# Altium project UZ_D_Optical_Daughter.PrjPcb
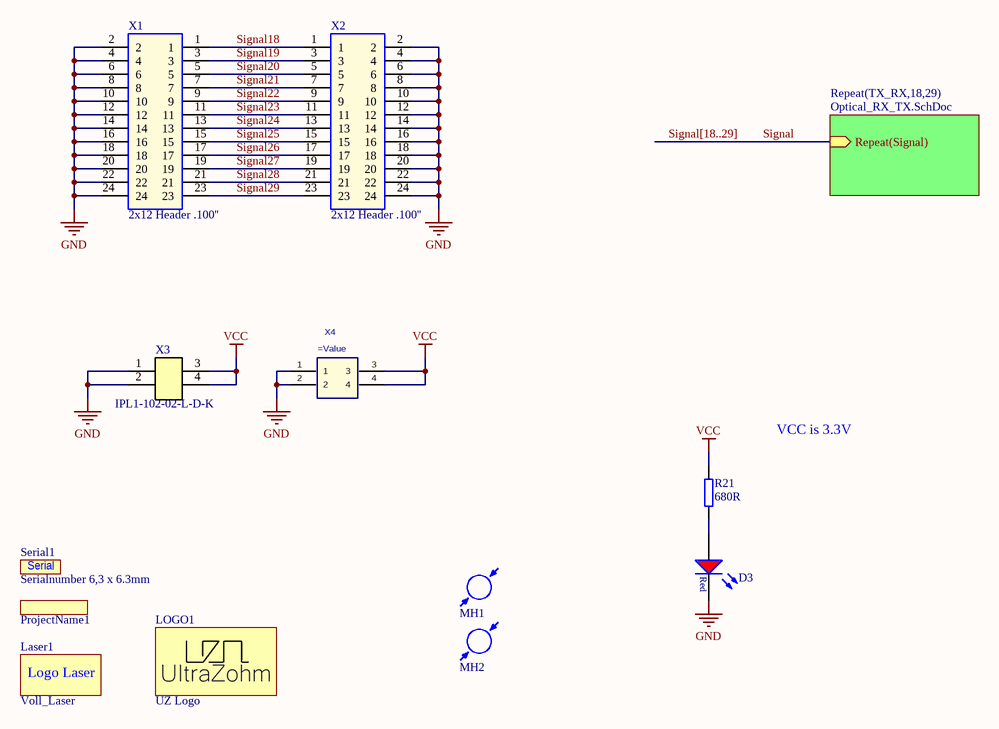
[diagram p0: TopSheet.SchDoc]
Author: E. Aufderheide; AuthorParam: E. Aufderheide; Date: 09/25; GGG: 000; PPP: 018; ProjectName: Digital_Optical_Daugther; ProjectRevision: Rev02; Rev: 02; vv: vv
2 sheets, 252 parts. Net scope: hierarchical (ports join the sheet entries above them; power ports are global).
Board file: UZ_D_Optical_Daughter.PcbDoc
Sheets:
  TopSheet.SchDoc
    TX_RX18 = Optical_RX_TX.SchDoc
    TX_RX19 = Optical_RX_TX.SchDoc
    TX_RX20 = Optical_RX_TX.SchDoc
    TX_RX21 = Optical_RX_TX.SchDoc
    TX_RX22 = Optical_RX_TX.SchDoc
    TX_RX23 = Optical_RX_TX.SchDoc
    TX_RX24 = Optical_RX_TX.SchDoc
    TX_RX25 = Optical_RX_TX.SchDoc
    TX_RX26 = Optical_RX_TX.SchDoc
    TX_RX27 = Optical_RX_TX.SchDoc
    TX_RX28 = Optical_RX_TX.SchDoc
    TX_RX29 = Optical_RX_TX.SchDoc

## Sheet TopSheet.SchDoc
size A4; Author: E. Aufderheide; CompanyName: Technische Hochschule Nürnberg Georg Simon Ohm; Organization: UltraZohm; Address1: Kesslerplatz 12; Address2: 90489 Nürnberg; Address3: GERMANY; DocumentNumber: 1; SheetNumber: 1; SheetTotal: 2; Website: www.ultrazohm.com

### Parts
D3  150060RS75000  [WL-SMCW_0603]  (value not drawn)
Laser1  Voll_Laser  [Voll_Laser]  (no BOM)
LOGO1  UZ Logo  [UZ_Logo_small]  (no BOM)
MH1  (no value)  [MH_2.8]  (no BOM)
MH2  (no value)  [MH_2.8]  (no BOM)
ProjectName1  Project Name, Rev  [ID_ProjectRev]  (value not drawn)  (no BOM)
R21  680R  [R_0603_N]
Serial1  Serialnumber 6,3 x 6.3mm  [Serial_6.3x6.3mm]  (no BOM)
X1  2x12 Header .100''  [TST-112-01-G-D]
X2  2x12 Header .100''  [TST-112-01-G-D]
X3  IPL1-102-02-L-D-K  [IPL1-102-02-L-D-K-0]
X4  (no value)  [IPL1-102-01-L-D-K]

### Sub-sheets
Repeat(TX_RX,18,29) = Optical_RX_TX.SchDoc: Repeat(Signal) (in)

### Nets
GND: D3.1(K) X1.2 X1.4 X1.6 X1.8 X1.10 X1.12 X1.14 X1.16 X1.18 X1.20 X1.22 X1.24 X2.2 X2.4 X2.6 X2.8 X2.10 X2.12 X2.14 X2.16 X2.18 X2.20 X2.22 X2.24 X3.1 X3.2 X4.1 X4.2
VCC: R21.2 X3.3 X3.4 X4.3 X4.4
Signal: sheet Repeat(TX_RX,18,29)/Repeat(Signal)
Signal18: X1.1 X2.1
Signal19: X1.3 X2.3
Signal20: X1.5 X2.5
Signal21: X1.7 X2.7
Signal22: X1.9 X2.9
Signal23: X1.11 X2.11
Signal24: X1.13 X2.13
Signal25: X1.15 X2.15
Signal26: X1.17 X2.17
Signal27: X1.19 X2.19
Signal28: X1.21 X2.21
Signal29: X1.23 X2.23
NetD3_2: D3.2(A) R21.1

### Buses and harness runs
bus Signal[18..29]

### Notes on the sheet
- VCC is 3.3V
- Title
- Revision:
- Design Engineer:
- Date:
- Project:
- Sheet
- of
- (in symbol SerialNumber) Serial
- (in symbol Voll_Laser) Logo Laser

### Library data of the parts
D3 = LED_Red_0603: WL-SMCW SMD Mono-color Chip LED Waterclear, size 0603, Red, 2 V, 140°; Forward Voltage: 2 V; Luminous Intensity: 250 mcd; Peak Wavelength: 630 nm; Dominant Wavelength: 625 nm; MF: Wuerth Elektronik; Published Date: Sep. 2017; ComponentLink1Description: Manufacturer; ComponentLink1URL: http://www.we-online.de; ComponentLink2Description: Datasheet; ComponentLink2URL: http://katalog.we-online.com/led/datasheet/150060RS75000.pdf; MPN: 150060RS75000; Size: 0603; Viewing Angle: 140°; Emitting Color: Red; Value: 150060RS75000; Package: 0603; Created: 2018_09_06_AGeiger; Supplier 1: Farnell; Supplier Part Number 1: 2322071; Supplier 2: Mouser; Supplier Part Number 2: 710-150060RS75000; Supplier 3: Digi-Key; Supplier Part Number 3: 732-4978-1-ND; LCSC Part Number: C2286
Laser1 = Voll_Laser: Logo Laser Warning Sign
LOGO1 = UZ Logo: UltraZohm Logo on PCB; Created: Jan2021_Liegmann; Value: UZ Logo
MH1 MH2 = Mounting Hole: Non plated through hole
ProjectName1 = ID_ProjectRev: Project Name and Revision Number; Created: 2018_11_23_AGeiger; Value: Project Name, Rev
R21 = R_0603: SMD Resistor 0603; MPN: CR0603-FX-3901ELF; Tolerance: 1%; Voltage: 75V; Power: 100 mW; MF: Bourns; Package: 0603; Value: 680R; Created: 2018_09_06_AGeiger; Supplier 1: Mouser; Supplier Part Number 1: 652-CR0603-FX3901ELF; LCSC Part Number: C23228
Serial1 = SerialNumber: Created: 2018_09_18_AGeiger; Value: Serialnumber 6,3 x 6.3mm
X1 X2 = TST-112-01-G-D: Double Row, 12 positions, Shrouded Terminal Header .100''; MF: Samtec; Created: 2020_04_Kreppel; MPN: TST-112-01-G-D; Supplier 1: Mouser; Supplier Part Number 1: 200-TST11201GD; LCSC Part Number: C5372869
X3 = IPL1-102-02-L-D-K: P=2.54mm Wire To Board Connector ROHS; Manufacturer: SAMTEC; Created from: KIlhan; Number of positions: 2; Manufacturer Part Number: IPL1-102-02-L-D-K; PartID: 59; Created On: 20/03/2025 08:58:37; ComponentLink1Description: Datasheet; ComponentLink1URL: https://wmsc.lcsc.com/wmsc/upload/file/pdf/v2/lcsc/2312312026_Samtec-IPL1-102-02-L-D-K_C7437440.pdf; Component Type: Samtec Connector; Device Package: Connector; Last Updated: 20/03/2025 09:02:48; Mounting Type: THT; Operating Temperature: -55 - +125 °C; Supplier 1: Mouser; Supplier Part Number 1: 200-IPL110202LDK; Supplier 2: LCSC; Supplier Part Number 2: C7437440; Type: Connector; Live Cycle Status: 1; Number of rows: 2; LCSC Part Number: C7437440; Stock number: not stored
X4 = IPL1-102-XX-X-D-X: 2.54mm Double Row Terminal Assembly, Right-Angled; Manufacturer: SAMTEC; Created: 2018_05_02_AGeiger; Value: =MPN; MPN: IPL1-102-01-L-D-K; LCSC Part Number: C5714565

## Sheet Optical_RX_TX.SchDoc
size A4; CompanyName: Technische Hochschule Nürnberg Georg Simon Ohm; Organization: UltraZohm; Address1: Kesslerplatz 12; Address2: 90489 Nürnberg; Address3: GERMANY; DocumentNumber: 2; SheetNumber: 2; SheetTotal: 2; Website: www.ultrazohm.com
Used 12 times, as channels TX_RX18, TX_RX19, TX_RX20, TX_RX21, TX_RX22, TX_RX23, TX_RX24, TX_RX25, TX_RX26, TX_RX27, TX_RX28, TX_RX29. Parts and nets are listed once, with the designators drawn on the sheet.
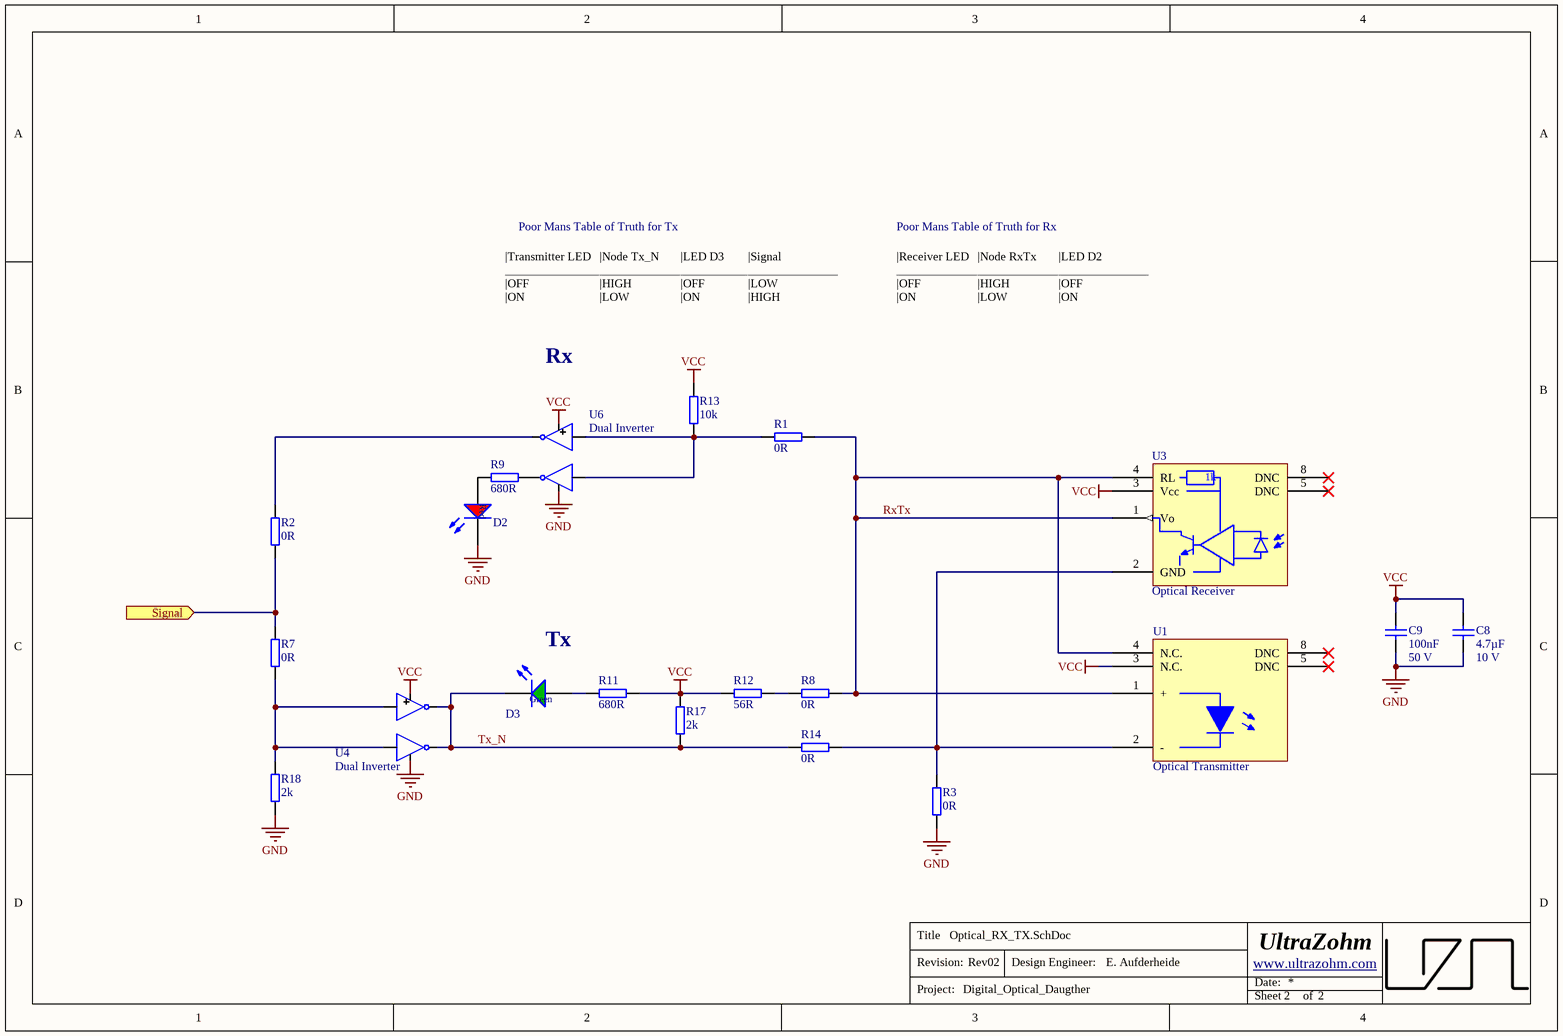
[diagram p1: Optical_RX_TX.SchDoc]

### Parts
C8  Voltage: 10 V  [CAP_2012X06N]  (hidden comment: 4.7µF)
C9  Rated Voltage: 50 V  [C_0603(1608)100_L]  (hidden comment: 100nF)
D2  150060RS75000  [WL-SMCW_0603]  (value not drawn)
D3  150060GS75000  [WL-SMCW_0603]  (value not drawn)
R1  0R  [R_0603_N]
R2  0R  [R_0603_N]
R3  0R  [R_0603_N]
R7  0R  [R_0603_N]
R8  0R  [R_0603_N]
R9  680R  [R_0603_N]
R11  680R  [R_0603_N]
R12  56R  [RES_2012X06N]
R13  10k  [R_0603_TE]
R14  0R  [R_0603_N]
R17  2k  [R_0603_N]
R18  2k  [R_0603_N]
U1  Optical Transmitter  [HFBRx5XX]
U3  Optical Receiver  [HFBRx5XX]
U4  Dual Inverter  [SN74LVC2GU04DCKR]
U6  Dual Inverter  [SN74LVC2GU04DCKR]

### Ports
Signal (in)

### Nets
GND: C8.2 C9.2 D2.1(K) R3.2 R18.1 U4.2(GND) U6.2(GND)
VCC: C8.1 C9.1 R11.1 R12.1 R13.2 R17.2 U1.3(N.C.) U3.3(Vcc) U4.5(VCC) U6.5(VCC)
RxTx: R1.2 R8.2 U1.1(+) U1.4(N.C.) U3.1(Vo) U3.4(RL)
Signal: R2.1 R7.2 ; port Signal
Tx_N: D3.1(K) R14.1 R17.1 U4.4(OUT2) U4.6(OUT2)
NetD2_2: D2.2(A) R9.2
NetD3_2: D3.2(A) R11.2
NetR1_1: R1.1 R13.1 U6.1(IN1) U6.3(IN2)
NetR2_2: R2.2 U6.6(OUT2)
NetR3_1: R3.1 R14.2 U1.2(-) U3.2(GND)
NetR7_1: R7.1 R18.2 U4.1(IN1) U4.3(IN2)
NetR8_1: R8.1 R12.2
NetR9_1: R9.1 U6.4(OUT2)

Not connected (* = marked no-connect by the designer): U1 5(DNC)* 8(DNC)*; U3 5(DNC)* 8(DNC)*

### Channels
TX_RX18: designators end in A; ports Signal=Signal18
TX_RX19: designators end in B; ports Signal=Signal19
TX_RX20: designators end in C; ports Signal=Signal20
TX_RX21: designators end in D; ports Signal=Signal21
TX_RX22: designators end in E; ports Signal=Signal22
TX_RX23: designators end in F; ports Signal=Signal23
TX_RX24: designators end in G; ports Signal=Signal24
TX_RX25: designators end in H; ports Signal=Signal25
TX_RX26: designators end in I; ports Signal=Signal26
TX_RX27: designators end in J; ports Signal=Signal27
TX_RX28: designators end in K; ports Signal=Signal28
TX_RX29: designators end in L; ports Signal=Signal29

### Notes on the sheet
- Poor Mans Table of Truth for Tx
- Poor Mans Table of Truth for Rx
- |Transmitter LED
  _________________
  |OFF
  |ON
- |Node Tx_N
  _________________
  |HIGH
  |LOW
- |LED D3
  _______________
  |OFF
  |ON
- GATE
  _______
  LOW
  HIGH
- |Signal
  _______________
  |LOW
  |HIGH
- |Receiver LED
  ________________
  |OFF
  |ON
- |Node RxTx
  _________________
  |HIGH
  |LOW
- |LED D2
  _______________
  |OFF
  |ON
- Rx
- Tx
- Title
- Revision:
- Design Engineer:
- Date:
- Project:
- Sheet
- of
- (in symbol HFBR-2528Z) 1k

### Library data of the parts
C8 = C_0805: CAP 0805 (2012 Metric) SMD; MPN: LMF212B7475KGHT; Tolerance: ±10%; Case-Metric: 2012; Dielectric: X7R; MF: Taiyo Yuden; Case-EIA: 0805; Max Thickness: 1 mm; Technology: SMT; Created: 2018_09_06_AGeiger; Supplier 1: Mouser; Supplier Part Number 1: 963-LMF212B7475KGHT; Value: 4.7µF; Package: 0805; LCSC Part Number: C1779
C9 = C_0603: CAP 0603 (1608 Metric) SMD; Tolerance: ±5%; Case-Metric: 1608; Case-EIA: 0603; Max Thickness: 1 mm; Technology: SMT; Created: 2018_09_06_AGeiger; Dielectric: *; Supplier 1: *; Supplier Part Number 1: *; MF: *; MPN: *; Value: 100nF; Package: 0603; LCSC Part Number: C14663
D2 = LED_Red_0603: as D3 on sheet TopSheet; Published Date: Sep. 2017; ComponentLink1Description: Manufacturer; ComponentLink1URL: http://www.we-online.de; ComponentLink2Description: Datasheet; ComponentLink2URL: http://katalog.we-online.com/led/datasheet/150060RS75000.pdf; MPN: 150060RS75000; Size: 0603; Viewing Angle: 140°; Emitting Color: Red; Value: 150060RS75000; Package: 0603; Created: 2018_09_06_AGeiger; Supplier 1: Farnell; Supplier Part Number 1: 2322071; Supplier 2: Mouser; Supplier Part Number 2: 710-150060RS75000; Supplier 3: Digi-Key; Supplier Part Number 3: 732-4978-1-ND; LCSC Part Number: C2286
D3 = LED_Green_0603: WL-SMCW SMD Mono-color Chip LED Waterclear, size 0603, Green, 3.2 V, 140°; Forward Voltage: 3.2 V; Luminous Intensity: 430 mcd; Peak Wavelength: 515 nm; Dominant Wavelength: 520 nm; MF: Wuerth Elektronik; Published Date: Sep. 2017; ComponentLink1Description: Manufacturer; ComponentLink1URL: http://www.we-online.de; ComponentLink2Description: Datasheet; ComponentLink2URL: http://katalog.we-online.com/led/datasheet/150060GS75000.pdf; MPN: 150060GS75000; Size: 0603; Viewing Angle: 140°; Emitting Color: Green; Value: 150060GS75000; Package: 0603; Created: 2018_09_06_AGeiger; Supplier 1: Farnell; Supplier Part Number 1: 2322070; Supplier 2: Mouser; Supplier Part Number 2: 710-150060GS75000; Supplier 3: Digi-Key; Supplier Part Number 3: 732-4971-1-ND; LCSC Part Number: C965804
R1 R2 R7 R8 R14 = R_0603_JLC: SMD Resistor 0603; Tolerance: 1%; Voltage: 75V; Power: 100 mW; Package: 0603; Value: 0R; Created: 2018_09_06_AGeiger; Supplier 1: Mouser; Supplier Part Number 1: 71-CRCW06030000Z0EBC; LCSC Part Number: C21189
R3 = R_0603: SMD Resistor 0603; MPN: CRCW06030000Z0EBC; Tolerance: 1%; Voltage: 75V; Power: 100 mW; MF: Vishay; Package: 0603; Value: 0R; Created: 2018_09_06_AGeiger; Supplier 1: Mouser; Supplier Part Number 1: 71-CRCW06030000Z0EBC; LCSC Part Number: C21189
R9 R11 = R_0603: as R21 on sheet TopSheet; Package: 0603; Value: 680R; Created: 2018_09_06_AGeiger; Supplier 1: Mouser; Supplier Part Number 1: 652-CR0603-FX3901ELF; LCSC Part Number: C23228
R12 = R_0805: SMD Resistor 0805; MPN: CR0805-FX-1200ELF; Case_EIA: 0805; MF: Bourns; Voltage: 150 V; Power: 125 mW; Tolerance: 1%; Value: 56R; Supplier 1: Mouser; Supplier Part Number 1: 652-CR0805FX-1200ELF*; LCSC Part Number: C17437
R13 = UZgen_R_0603_10k: Generic resistor; Manufacturer: UZgen; Tolerance: 1 %; Created from: AGeiger; Manufacturer Part Number: UZgen_R_0603_10k; PartID: 1; Created On: 02.07.2024 14:34:53; Value: 10k; Device Package: 0603; Mounting Type: SMD; Last Updated: 02.07.2024 14:37:16; LCSC Part Number: C25804
R17 R18 = R_0603: SMD Resistor 0603; MPN: RC0603FR-072KL; Tolerance: 1%; Voltage: 75 V; Power: 100 mW; MF: Yageo; Package: 0603; Value: 2k; Created: 2018_09_06_AGeiger; Supplier 1: Mouser; Supplier Part Number 1: 603-RC0603FR-072KL; LCSC Part Number: C22975
U1 = HFBR-1521Z: Fibre Optic Transmitters, Link Horiz 5MBd Tx RoHS; MF: Broadcom/Avago; Wavelength: 660 nm; Foreward Current: 60 mA; Supply Voltage: 5V; Created: 2019_04_09_Kreppel; MPN: HFBR-1521Z; Data Rate: 5 MBd; Supplier 1: Mouser; Supplier 2: Digi-Key; Supplier Part Number 1: 630-HFBR-1521Z; Supplier Part Number 2: 516-2043-ND
U3 = HFBR-2528Z: Fibre Optic Receivers, LINK HORIZ 5MBd RC VR RoHS; MPN: HFBR-2521Z; Suppier Part Number 2: 516-2062-ND; MF: Boadcom/Avago; Wavelength: 660 nm; Iout max: 25 mA; Supply Voltage: 5V; Created: 2019_04_09_Kreppel; Data Rate: 5 MBd; Supplier 1: Mouser; Supplier 2: Digi-Key; Supplier Part Number 1: 630-HFBR-2521Z
U4 U6 = SN74LVC2GU04DCKR: This dual inverter is designed for 1.65-V to 5.5-V VCC / operation.; JLCSMT Rotation: 180; LCSC Part Number: C116660

## Nets that join several sheets
GND: TopSheet (29 pins), TX_RX18 (7 pins), TX_RX19 (7 pins), TX_RX20 (7 pins), TX_RX21 (7 pins), TX_RX22 (7 pins), TX_RX23 (7 pins), TX_RX24 (7 pins), TX_RX25 (7 pins), TX_RX26 (7 pins), TX_RX27 (7 pins), TX_RX28 (7 pins), TX_RX29 (7 pins)
VCC: TopSheet (5 pins), TX_RX18 (10 pins), TX_RX19 (10 pins), TX_RX20 (10 pins), TX_RX21 (10 pins), TX_RX22 (10 pins), TX_RX23 (10 pins), TX_RX24 (10 pins), TX_RX25 (10 pins), TX_RX26 (10 pins), TX_RX27 (10 pins), TX_RX28 (10 pins), TX_RX29 (10 pins)
Signal18: TopSheet (X1.1 X2.1), TX_RX18 (R2A.1 R7A.2)
Signal19: TopSheet (X1.3 X2.3), TX_RX19 (R2B.1 R7B.2)
Signal20: TopSheet (X1.5 X2.5), TX_RX20 (R2C.1 R7C.2)
Signal21: TopSheet (X1.7 X2.7), TX_RX21 (R2D.1 R7D.2)
Signal22: TopSheet (X1.9 X2.9), TX_RX22 (R2E.1 R7E.2)
Signal23: TopSheet (X1.11 X2.11), TX_RX23 (R2F.1 R7F.2)
Signal24: TopSheet (X1.13 X2.13), TX_RX24 (R2G.1 R7G.2)
Signal25: TopSheet (X1.15 X2.15), TX_RX25 (R2H.1 R7H.2)
Signal26: TopSheet (X1.17 X2.17), TX_RX26 (R2I.1 R7I.2)
Signal27: TopSheet (X1.19 X2.19), TX_RX27 (R2J.1 R7J.2)
Signal28: TopSheet (X1.21 X2.21), TX_RX28 (R2K.1 R7K.2)
Signal29: TopSheet (X1.23 X2.23), TX_RX29 (R2L.1 R7L.2)

## Assembly variants
01-12Rx: not fitted R7A R7B R7C R7D R7E R7F R7G R7H R7I R7J R7K R7L R8A R8B R8C R8D R8E R8F R8G R8H R8I R8J R8K R8L R14A R14B R14C R14D R14E R14F R14G R14H R14I R14J R14K R14L U1A U1B U1C U1D U1E U1F U1G U1H U1I U1J U1K U1L X2 X4
00-12Tx: not fitted R1A R1B R1C R1D R1E R1F R1G R1H R1I R1J R1K R1L R2A R2B R2C R2D R2E R2F R2G R2H R2I R2J R2K R2L R3A R3B R3C R3D R3E R3F R3G R3H R3I R3J R3K R3L U3A U3B U3C U3D U3E U3F U3G U3H U3I U3J U3K U3L X2 X4